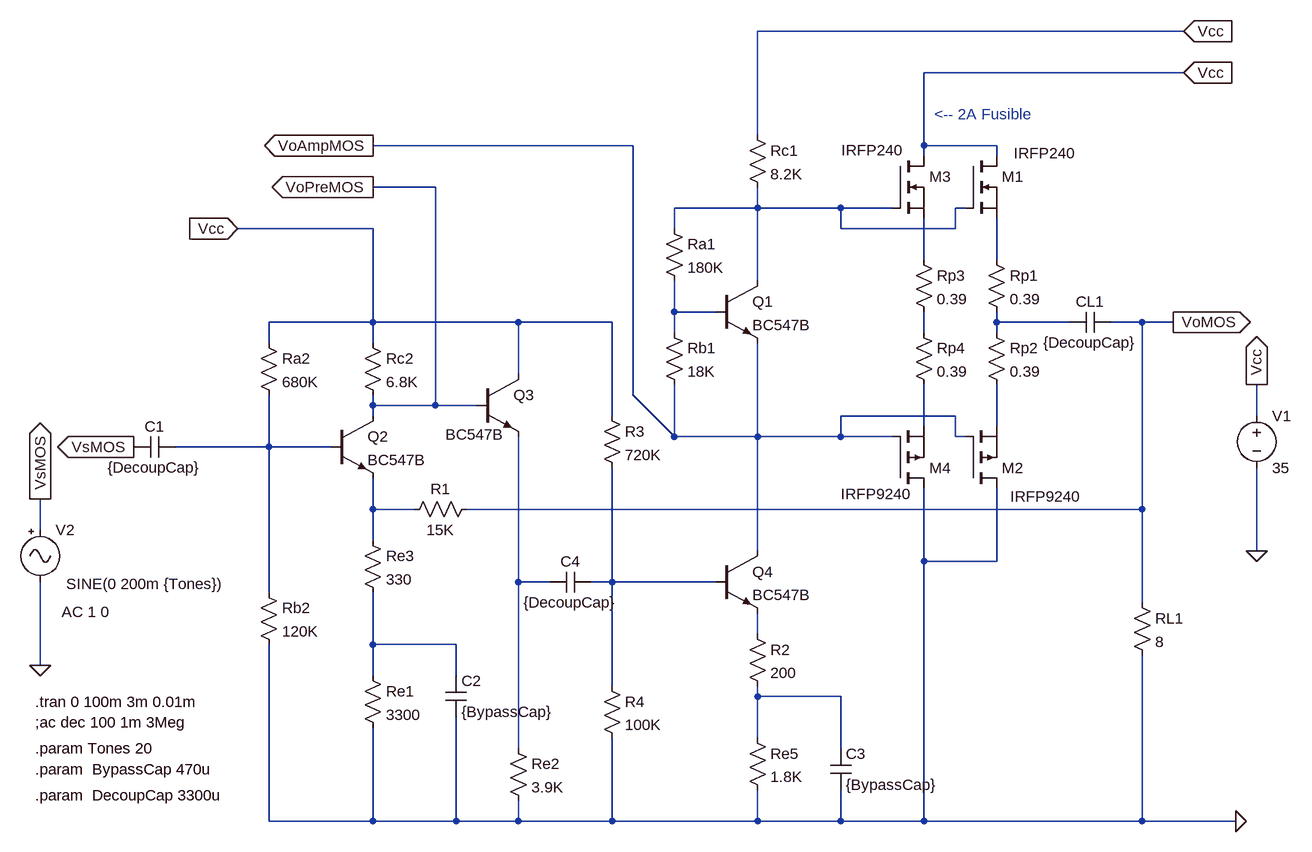
[diagram p0: schematic EA2-ProyectoFinal-AmplificadorDeBajaPotencia_MOS_Only_27-12-2020.asc]
EA2-ProyectoFinal-AmplificadorDeBajaPotencia_MOS_Only_27-12-2020.asc, the LTspice schematic file:
Version 4
SHEET 1 3476 2964
WIRE 1392 -640 736 -640
WIRE 1392 -576 992 -576
WIRE 736 -480 736 -640
WIRE 544 -464 144 -464
WIRE 992 -464 992 -576
WIRE 1104 -464 992 -464
WIRE 992 -448 992 -464
WIRE 1104 -448 1104 -464
WIRE 240 -400 144 -400
WIRE 736 -368 736 -400
WIRE 736 -368 608 -368
WIRE 864 -368 736 -368
WIRE 944 -368 864 -368
WIRE 1056 -368 1040 -368
WIRE 144 -336 -64 -336
WIRE 608 -336 608 -368
WIRE 864 -336 864 -368
WIRE 1040 -336 1040 -368
WIRE 1040 -336 864 -336
WIRE 992 -288 992 -352
WIRE 1104 -288 1104 -352
WIRE 736 -256 736 -368
WIRE 608 -208 608 -256
WIRE 672 -208 608 -208
WIRE 144 -192 144 -336
WIRE 144 -192 -16 -192
WIRE 368 -192 144 -192
WIRE 512 -192 368 -192
WIRE 1104 -192 1104 -208
WIRE 1216 -192 1104 -192
WIRE 1328 -192 1280 -192
WIRE 1376 -192 1328 -192
WIRE 608 -176 608 -208
WIRE 992 -176 992 -208
WIRE 1104 -176 1104 -192
WIRE -16 -160 -16 -192
WIRE 144 -160 144 -192
WIRE 368 -112 368 -192
WIRE 544 -80 544 -464
WIRE 144 -64 144 -80
WIRE 240 -64 240 -400
WIRE 240 -64 144 -64
WIRE 304 -64 240 -64
WIRE 144 -48 144 -64
WIRE 512 -48 512 -192
WIRE 1040 -48 864 -48
WIRE 1504 -48 1504 -96
WIRE 992 -32 992 -96
WIRE 1104 -32 1104 -96
WIRE 608 -16 608 -96
WIRE 608 -16 544 -80
WIRE 736 -16 736 -160
WIRE 736 -16 608 -16
WIRE 864 -16 864 -48
WIRE 864 -16 736 -16
WIRE 944 -16 864 -16
WIRE 1040 -16 1040 -48
WIRE 1056 -16 1040 -16
WIRE -16 0 -16 -80
WIRE -16 0 -160 0
WIRE 80 0 -16 0
WIRE 144 96 144 48
WIRE 208 96 144 96
WIRE 1328 96 1328 -192
WIRE 1328 96 288 96
WIRE -368 128 -368 80
WIRE 144 144 144 96
WIRE 736 160 736 -16
WIRE 1504 160 1504 32
WIRE 992 176 992 64
WIRE 1104 176 1104 64
WIRE 1104 176 992 176
WIRE 368 208 368 -16
WIRE 416 208 368 208
WIRE 512 208 512 32
WIRE 512 208 480 208
WIRE 672 208 512 208
WIRE -16 224 -16 0
WIRE 1328 240 1328 96
WIRE 736 288 736 256
WIRE 144 304 144 224
WIRE 272 304 144 304
WIRE -368 336 -368 208
WIRE 144 352 144 304
WIRE 272 352 272 304
WIRE 512 368 512 208
WIRE 736 384 736 368
WIRE 864 384 736 384
WIRE 736 448 736 384
WIRE 368 464 368 208
WIRE 864 464 864 384
WIRE -16 576 -16 304
WIRE 144 576 144 432
WIRE 144 576 -16 576
WIRE 272 576 272 416
WIRE 272 576 144 576
WIRE 368 576 368 544
WIRE 368 576 272 576
WIRE 512 576 512 448
WIRE 512 576 368 576
WIRE 736 576 736 528
WIRE 736 576 512 576
WIRE 864 576 864 528
WIRE 864 576 736 576
WIRE 992 576 992 176
WIRE 992 576 864 576
WIRE 1328 576 1328 320
WIRE 1328 576 992 576
WIRE 1472 576 1328 576
FLAG 1504 160 0
FLAG 1504 -96 Vcc
IOPIN 1504 -96 Out
FLAG 1392 -576 Vcc
IOPIN 1392 -576 In
FLAG 1376 -192 VoMOS
IOPIN 1376 -192 Out
FLAG 1392 -640 Vcc
IOPIN 1392 -640 In
FLAG -64 -336 Vcc
IOPIN -64 -336 In
FLAG 144 -400 VoPreMOS
IOPIN 144 -400 Out
FLAG -224 0 VsMOS
IOPIN -224 0 Out
FLAG -368 80 VsMOS
IOPIN -368 80 Out
FLAG -368 336 0
FLAG 144 -464 VoAmpMOS
IOPIN 144 -464 Out
FLAG 1472 576 0
SYMBOL voltage 1504 -64 R0
SYMATTR InstName V1
SYMATTR Value 35
SYMBOL res 1312 224 R0
SYMATTR InstName RL1
SYMATTR Value 8
SYMBOL cap 1280 -208 R90
WINDOW 0 0 32 VBottom 2
WINDOW 3 32 32 VTop 2
SYMATTR InstName CL1
SYMATTR Value {DecoupCap}
SYMBOL res 720 -496 R0
SYMATTR InstName Rc1
SYMATTR Value 8.2K
SYMBOL res 592 -352 R0
SYMATTR InstName Ra1
SYMATTR Value 180K
SYMBOL res 592 -192 R0
SYMATTR InstName Rb1
SYMATTR Value 18K
SYMBOL npn 672 -256 R0
SYMATTR InstName Q1
SYMATTR Value BC547B
SYMBOL npn 80 -48 R0
SYMATTR InstName Q2
SYMATTR Value BC547B
SYMBOL res 128 336 R0
SYMATTR InstName Re1
SYMATTR Value 3300
SYMBOL res 128 -176 R0
SYMATTR InstName Rc2
SYMATTR Value 6.8K
SYMBOL cap -160 -16 R90
WINDOW 0 0 32 VBottom 2
WINDOW 3 32 32 VTop 2
SYMATTR InstName C1
SYMATTR Value {DecoupCap}
SYMBOL res -32 -176 R0
SYMATTR InstName Ra2
SYMATTR Value 680K
SYMBOL res -32 208 R0
SYMATTR InstName Rb2
SYMATTR Value 120K
SYMBOL npn 304 -112 R0
WINDOW 3 -48 93 Left 2
SYMATTR Value BC547B
SYMATTR InstName Q3
SYMBOL res 352 448 R0
SYMATTR InstName Re2
SYMATTR Value 3.9K
SYMBOL cap 256 352 R0
SYMATTR InstName C2
SYMATTR Value {BypassCap}
SYMBOL res 128 128 R0
SYMATTR InstName Re3
SYMATTR Value 330
SYMBOL npn 672 160 R0
SYMATTR InstName Q4
SYMATTR Value BC547B
SYMBOL Misc\\signal -368 112 R0
WINDOW 3 40 99 Left 2
WINDOW 123 33 142 Left 2
WINDOW 39 0 0 Left 0
SYMATTR Value SINE(0 200m {Tones})
SYMATTR Value2 AC 1 0
SYMATTR InstName V2
SYMBOL res 720 432 R0
SYMATTR InstName Re5
SYMATTR Value 1.8K
SYMBOL res 304 80 R90
WINDOW 0 0 56 VBottom 2
WINDOW 3 32 56 VTop 2
SYMATTR InstName R1
SYMATTR Value 15K
SYMBOL res 1088 -304 R0
SYMATTR InstName Rp1
SYMATTR Value 0.39
SYMBOL res 1088 -192 R0
SYMATTR InstName Rp2
SYMATTR Value 0.39
SYMBOL nmos 1056 -448 R0
WINDOW 3 74 -4 Left 2
SYMATTR Value IRFP240
SYMATTR InstName M1
SYMBOL pmos 1056 64 M180
WINDOW 3 69 -12 Left 2
SYMATTR Value IRFP9240
SYMATTR InstName M2
SYMBOL cap 848 464 R0
SYMATTR InstName C3
SYMATTR Value {BypassCap}
SYMBOL res 720 272 R0
SYMATTR InstName R2
SYMATTR Value 200
SYMBOL res 496 -64 R0
SYMATTR InstName R3
SYMATTR Value 720K
SYMBOL res 496 352 R0
SYMATTR InstName R4
SYMATTR Value 100K
SYMBOL cap 480 192 R90
WINDOW 0 0 32 VBottom 2
WINDOW 3 32 32 VTop 2
SYMATTR InstName C4
SYMATTR Value {DecoupCap}
SYMBOL res 976 -304 R0
SYMATTR InstName Rp3
SYMATTR Value 0.39
SYMBOL res 976 -192 R0
SYMATTR InstName Rp4
SYMATTR Value 0.39
SYMBOL nmos 944 -448 R0
WINDOW 3 -79 -9 Left 2
SYMATTR Value IRFP240
SYMATTR InstName M3
SYMBOL pmos 944 64 M180
WINDOW 3 -80 -8 Left 2
SYMATTR Value IRFP9240
SYMATTR InstName M4
TEXT -376 392 Left 2 !.tran 0 100m 3m 0.01m
TEXT -376 424 Left 2 !;ac dec 100 1m 3Meg
TEXT -376 464 Left 2 !.param Tones 20
TEXT 1008 -512 Left 2 ;<-- 2A Fusible
TEXT -376 496 Left 2 !.param  BypassCap 470u
TEXT -376 536 Left 2 !.param  DecoupCap 3300u

The netlist it stands for:
* EA2-ProyectoFinal-AmplificadorDeBajaPotencia_MOS_Only_27-12-2020.asc
V1 Vcc 0 35
RL1 VoMOS 0 8
CL1 VoMOS N005 {DecoupCap}
Rc1 Vcc N001 8.2K
Ra1 N001 N004 180K
Rb1 N004 VoAmpMOS 18K
Q1 N001 N004 VoAmpMOS 0 BC547B
Q2 VoPreMOS N009 N010 0 BC547B
Re1 N014 0 3300
Rc2 Vcc VoPreMOS 6.8K
C1 N009 VsMOS {DecoupCap}
Ra2 Vcc N009 680K
Rb2 N009 0 120K
Q3 Vcc VoPreMOS N011 0 BC547B
Re2 N011 0 3.9K
C2 N014 0 {BypassCap}
Re3 N010 N014 330
Q4 VoAmpMOS N012 N013 0 BC547B
V2 VsMOS 0 SINE(0 200m {Tones}) AC 1 0
Re5 N015 0 1.8K
R1 VoMOS N010 15K
Rp1 N003 N005 0.39
Rp2 N005 N008 0.39
M1 Vcc N001 N003 N003 IRFP240
M2 0 VoAmpMOS N008 N008 IRFP9240
C3 N015 0 {BypassCap}
R2 N013 N015 200
R3 Vcc N012 720K
R4 N012 0 100K
C4 N012 N011 {DecoupCap}
Rp3 N002 N006 0.39
Rp4 N006 N007 0.39
M3 Vcc N001 N002 N002 IRFP240
M4 0 VoAmpMOS N007 N007 IRFP9240
.model NPN NPN
.model PNP PNP
.lib standard.bjt
.model NMOS NMOS
.model PMOS PMOS
.lib standard.mos
.tran 0 100m 3m 0.01m
;ac dec 100 1m 3Meg
.param Tones 20
* <-- 2A Fusible
.param  BypassCap 470u
.param  DecoupCap 3300u
.backanno
.end